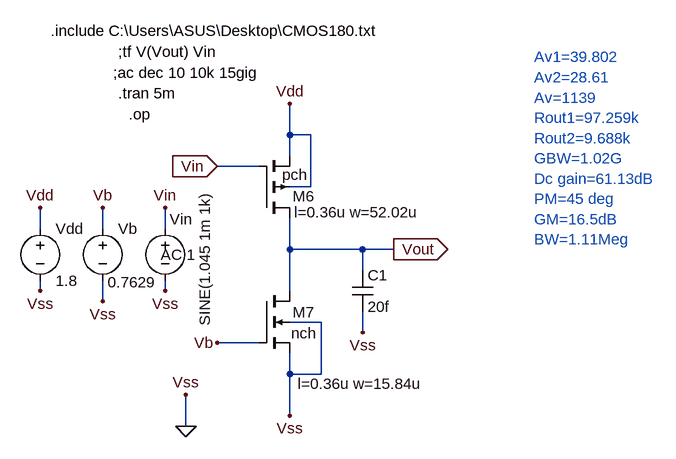
[diagram p0: schematic CSA_opamp_stage_2.asc]
CSA_opamp_stage_2.asc, the LTspice schematic file:
Version 4
SHEET 1 1520 680
WIRE 960 0 960 -48
WIRE 992 0 960 0
WIRE 960 32 960 0
WIRE 912 48 848 48
WIRE 992 80 992 0
WIRE 992 80 960 80
WIRE 576 144 576 112
WIRE 672 144 672 112
WIRE 768 144 768 112
WIRE 960 176 960 128
WIRE 1072 176 960 176
WIRE 1120 176 1072 176
WIRE 1072 208 1072 176
WIRE 576 240 576 224
WIRE 768 240 768 224
WIRE 960 240 960 176
WIRE 672 256 672 224
WIRE 1008 288 960 288
WIRE 1072 304 1072 272
WIRE 912 320 848 320
WIRE 960 368 960 336
WIRE 1008 368 1008 288
WIRE 1008 368 960 368
WIRE 960 432 960 368
WIRE 800 448 800 400
FLAG 1120 176 Vout
IOPIN 1120 176 Out
FLAG 960 432 Vss
FLAG 1072 304 Vss
FLAG 960 -48 Vdd
FLAG 848 320 Vb
FLAG 848 48 Vin
IOPIN 848 48 In
FLAG 768 240 Vss
FLAG 768 112 Vin
FLAG 800 448 0
FLAG 800 400 Vss
FLAG 576 240 Vss
FLAG 576 112 Vdd
FLAG 672 112 Vb
FLAG 672 256 Vss
SYMBOL pmos4 912 128 M180
WINDOW 123 55 9 Left 2
WINDOW 0 52 34 Left 2
WINDOW 3 36 67 Left 2
SYMATTR Value2 l=0.36u w=52.02u
SYMATTR InstName M6
SYMATTR Value pch
SYMBOL nmos4 912 240 R0
WINDOW 0 52 33 Left 2
WINDOW 3 50 65 Left 2
WINDOW 123 60 143 Left 2
SYMATTR InstName M7
SYMATTR Value nch
SYMATTR Value2 l=0.36u w=15.84u
SYMBOL cap 1056 208 R0
SYMATTR InstName C1
SYMATTR Value 20f
SYMBOL voltage 768 128 R0
WINDOW 123 -7 56 Left 2
WINDOW 39 0 0 Left 0
WINDOW 0 7 2 Left 2
WINDOW 3 61 -40 VRight 2
SYMATTR Value2 AC 1
SYMATTR InstName Vin
SYMATTR Value SINE(1.045 1m 1k)
SYMBOL voltage 576 128 R0
WINDOW 123 0 0 Left 0
WINDOW 39 0 0 Left 0
SYMATTR InstName Vdd
SYMATTR Value 1.8
SYMBOL voltage 672 128 R0
WINDOW 123 0 0 Left 0
WINDOW 39 0 0 Left 0
WINDOW 3 8 99 Left 2
SYMATTR Value 0.7629
SYMATTR InstName Vb
TEXT 592 -160 Left 2 !.include C:\\Users\\ASUS\\Desktop\\CMOS180.txt
TEXT 712 -32 Left 2 !.op
TEXT 696 -128 Left 2 !;tf V(Vout) Vin
TEXT 688 -96 Left 2 !;ac dec 10 10k 15gig
TEXT 696 -64 Left 2 !.tran 5m
TEXT 1336 -120 Left 2 ;Av1=39.802\nAv2=28.61\nAv=1139\nRout1=97.259k\nRout2=9.688k\nGBW=1.02G\nDc gain=61.13dB\nPM=45 deg\nGM=16.5dB\nBW=1.11Meg

The netlist it stands for:
* CSA_opamp_stage_2.asc
M6 Vout Vin Vdd Vdd pch l=0.36u w=52.02u
M7 Vout Vb 0 0 nch l=0.36u w=15.84u
C1 Vout 0 20f
Vin Vin 0 SINE(1.045 1m 1k) AC 1
Vdd Vdd 0 1.8
Vb Vb 0 0.7629
.model NMOS NMOS
.model PMOS PMOS
.lib standard.mos
.include C:\Users\ASUS\Desktop\CMOS180.txt
.op
;tf V(Vout) Vin
;ac dec 10 10k 15gig
.tran 5m
* Av1=39.802
* Av2=28.61
* Av=1139
* Rout1=97.259k
* Rout2=9.688k
* GBW=1.02G
* Dc gain=61.13dB
* PM=45 deg
* GM=16.5dB
* BW=1.11Meg
.backanno
.end